# Altium schematic sheet Coils.SchDoc
size A4
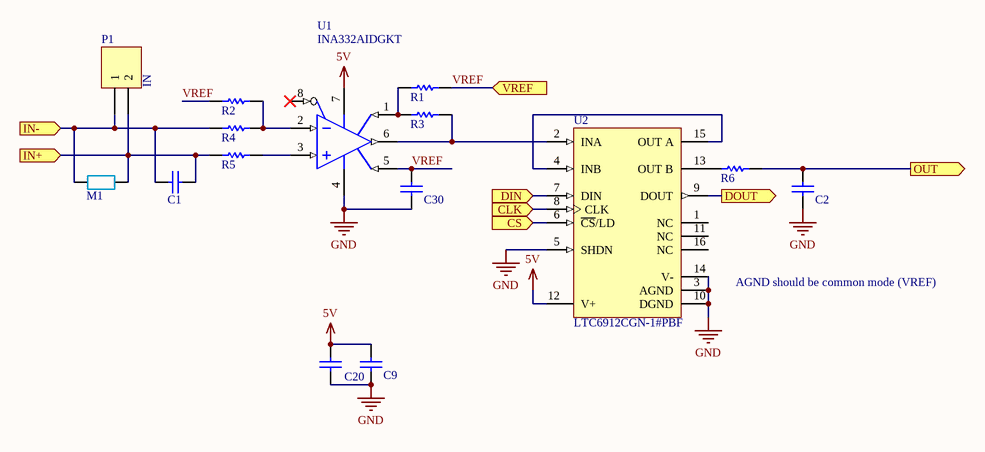
[diagram p0: Coils.SchDoc]

## Parts
C1  CAP 25V 0402(1005)  [CAPC0402(1005)60_N]  (value not drawn)
C2  CAP 100pF 25V 0402(1005)  [CAPC0402(1005)60_N]  (value not drawn)
C9  CAP 100nF 25V 0402(1005)  [CAPC0402(1005)60_N]  (value not drawn)
C20  CAP 100nF 25V 0402(1005)  [CAPC0402(1005)60_N]  (value not drawn)
C30  CAP 100nF 25V 0402(1005)  [CAPC0402(1005)60_N]  (value not drawn)
M1  Multi Footprint  [MULTI]  (value not drawn)
P1  IN  [HDR1X2]
R1  220R 1% 0402(1005)  [RESC0402(1005)_N]  (value not drawn)
R2  10K 1% 0402(1005)  [RESC0402(1005)_N]  (value not drawn)
R3  2K 1% 0402(1005)  [RESC0402(1005)_N]  (value not drawn)
R4  10K 1% 0402(1005)  [RESC0402(1005)_N]  (value not drawn)
R5  10K 1% 0402(1005)  [RESC0402(1005)_N]  (value not drawn)
R6  10K 1% 0402(1005)  [RESC0402(1005)_N]  (value not drawn)
U1  INA332AIDGKT  [TI-DGK8_N]
U2  LTC6912CGN-1#PBF  [LT-GN-16_N]

## Ports
CLK (in), CS (in), DIN (in), DOUT (out), IN+ (in), IN- (in), OUT (out), VREF (in)

## Nets
5V: C9.2 C20.2 U1.7(V+) U2.12(V+)
GND: C2.1 C9.1 C20.1 C30.1 U1.4(V-) U2.3(AGND) U2.5(SHDN) U2.10(DGND) U2.14(V-)
CLK: U2.8(CLK) ; port CLK
CS: U2.6(~{CS}/LD) ; port CS
DIN: U2.7(DIN) ; port DIN
DOUT: U2.9(DOUT) ; port DOUT
IN+: C1.2 M1.2 P1.2 R5.1 ; port IN+
IN-: C1.1 M1.1 P1.1 R4.1 ; port IN-
OUT: C2.2 R6.1 ; port OUT
VREF: C30.2 R1.2 R2.1 U1.5(REF) ; port VREF
NetR1_1: R1.1 R3.1 U1.1(RG)
NetR2_2: R2.2 R4.2 U1.2(VIN-)
NetR3_2: R3.2 U1.6(VOUT) U2.2(INA)
NetR5_2: R5.2 U1.3(VIN+)
NetR6_2: R6.2 U2.13(OUT_B)
NetU2_4: U2.4(INB) U2.15(OUT_A)

Not connected (* = marked no-connect by the designer): U1 8(SHUTDOWN)*; U2 1(NC) 11(NC) 16(NC)

## Notes on the sheet
- AGND should be common mode (VREF)

## Library data of the parts
C1 = CMP-1034-00714-1: CAP 25V ±1% 0402 (1005 Metric) Thickness 0.6mm SMD; Case-EIA: 0402; Case-Metric: 1005; Rated Voltage: 25 V; Tolerance: ±1%; Technology: SMT; Max Thickness: 0.6 mm
C2 = CMP-1034-01239-1: CAP 100pF 25V ±1% 0402 (1005 Metric) Thickness 0.6mm SMD; Case-Metric: 1005; Case-EIA: 0402; Tolerance: ±1%; Value: 100pF; Rated Voltage: 25 V; Max Thickness: 0.6 mm; Technology: SMT
C9 C20 C30 = CMP-1034-02073-1: CAP 100nF 25V ±20% 0402 (1005 Metric) Thickness 0.6mm SMD; Case-EIA: 0402; Case-Metric: 1005; Rated Voltage: 25 V; Value: 100nF; Tolerance: ±20%; Max Thickness: 0.6 mm; Technology: SMT
M1 = Multi
P1 = Header 2: Header, 2-Pin; LatestRevisionDate: 17-Jul-2002; LatestRevisionNote: Re-released for DXP Platform.; Publisher: Altium Limited
R1 = CMP-1011-00433-1: 220R 0.063W 1% 0402 (1005 Metric)  SMD; Case-Metric: 1005; Value: 220.00 Ohm; Case-EIA: 0402; Technology: SMT; Tolerance: 1 %; Power: 0.063 W
R2 R4-R6 = CMP-1011-00623-1: 10K 0.063W 1% 0402 (1005 Metric)  SMD; Case-Metric: 1005; Value: 10000.00 Ohm; Case-EIA: 0402; Tolerance: 1 %; Technology: SMT; Power: 0.063 W
R3 = CMP-1011-00542-1: 2K 0.063W 1% 0402 (1005 Metric)  SMD; Case-EIA: 0402; Case-Metric: 1005; Value: 2000.00 Ohm; Technology: SMT; Power: 0.063 W; Tolerance: 1 %
U1 = CMP-0944-00079-1: Low-Power, Single Supply, CMOS, Low Cost, Instrumentation Amplifier, -55 to 125 degC, 8-pin SOP (DGK8), Green (RoHS & no Sb/Br); Manufacturer: Texas Instruments; CMRR(Min)(dB): 60; Noise at 1kHz(Typ)(nV/rt(Hz)): 46; Non-Linearity (+/-)(Max)(%): 0.01; Input Offset (+/-)(Max)(uV): 8000; Gain(V/V): 5 to 1000; Quiescent Current (+/-)(Typ)(mA): 0.415; Number of Channels: 1; Vs(Max)(V): 5.5; Vs(Min)(V): 2.5; Code_JEDEC: MO-187; PartNumber: INA332AIDGKT; Mounting Technology: Surface Mount; ComponentLink2Description: Datasheet; ComponentLink1Description: Manufacturer URL; Input Bias Current (+/-)(Max)(nA): 0.01; ComponentLink3Description: Package Specification; ComponentLink3URL: http://www.ti.com/litv/pdf/mpds028d; DatasheetVersion: SBOS216B; PackageVersion: 4073329/E, 05/2006; ComponentLink1URL: http://www.ti.com/; PackageReference: DGK8; Eco-Plan: Green (RoHS & no Sb/Br); PackageDescription: 8-Pin Thin Small Outline, Body 3 x 3 mm, Pitch 0.65 mm; ComponentLink2URL: http://www.ti.com/general/docs/lit/getliterature.tsp?genericPartNumber=INA332&fileType=pdf; SubFamily: Single Supply
U2 = CMP-0359-00187-2: Dual Channel, Dual Programmable Gain Amplifier with Serial Digital Interface, 30 MHz Typical GBW, 16 V/us Typical SR, 2.7 to 10.5 V, 16-Pin SOP (GN-16), Commercial, Pb-Free; Manufacturer: Linear Technology; Linear Technology Part Number: LTC6912-1; Is (mA) Typical: 1.75; SR (V/us) Typical: 16; Vs Min (V): 2.7; Vs Max (V): 10.5; Channels (#): 2; GBW (MHz) Typical: 30; PackageDescription: 16-Lead Plastic SSOP, Body 4.9 x 3.9 mm, Pitch 0.635 mm; RoHS: Pb-Free; ComponentLink2URL: http://cds.linear.com/docs/en/datasheet/6912fa.pdf; ComponentLink2Description: Datasheet; ComponentLink3URL: http://cds.linear.com/docs/en/packaging/05081641_B_GN16.pdf; ComponentLink1URL: http://www.linear.com/; Type: PGA; DatasheetVersion: Rev. A; PackageReference: LT-GN-16; Mounting Technology: Surface Mount; ComponentLink3Description: Package Specification; PackageVersion: Rev B; Vos (mV) Typical: 2; PartNumber: LTC6912CGN-1#PBF; ComponentLink1Description: Manufacturer URL; RevisionNote: URLs updated